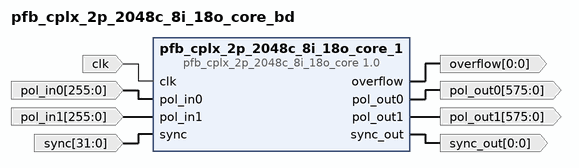
[diagram p0: block diagram of the top level]
# Vivado block design pfb_cplx_2p_2048c_8i_18o_core_bd, xcvu9p-flga2104-2-i, Vivado 2019.1.3
create_bd_design pfb_cplx_2p_2048c_8i_18o_core_bd

create_bd_port -dir I -type clk clk
create_bd_port -dir O -from 0 -to 0 -type data overflow
create_bd_port -dir I -from 255 -to 0 -type data pol_in0
create_bd_port -dir I -from 255 -to 0 -type data pol_in1
create_bd_port -dir O -from 575 -to 0 -type data pol_out0
create_bd_port -dir O -from 575 -to 0 -type data pol_out1
create_bd_port -dir I -from 31 -to 0 -type data sync
create_bd_port -dir O -from 0 -to 0 -type data sync_out

create_bd_cell -type ip -vlnv User_Company:SysGen:pfb_cplx_2p_2048c_8i_18o_core:1.0 pfb_cplx_2p_2048c_8i_18o_core_1

# ---- connections ----

connect_bd_net [get_bd_ports clk] [get_bd_pins pfb_cplx_2p_2048c_8i_18o_core_1/clk]
connect_bd_net [get_bd_pins pfb_cplx_2p_2048c_8i_18o_core_1/overflow] [get_bd_ports overflow]
connect_bd_net -net pol_in0_1 [get_bd_ports pol_in0] [get_bd_pins pfb_cplx_2p_2048c_8i_18o_core_1/pol_in0]
connect_bd_net -net pol_in1_1 [get_bd_ports pol_in1] [get_bd_pins pfb_cplx_2p_2048c_8i_18o_core_1/pol_in1]
connect_bd_net [get_bd_pins pfb_cplx_2p_2048c_8i_18o_core_1/pol_out0] [get_bd_ports pol_out0]
connect_bd_net [get_bd_pins pfb_cplx_2p_2048c_8i_18o_core_1/pol_out1] [get_bd_ports pol_out1]
connect_bd_net [get_bd_ports sync] [get_bd_pins pfb_cplx_2p_2048c_8i_18o_core_1/sync]
connect_bd_net [get_bd_pins pfb_cplx_2p_2048c_8i_18o_core_1/sync_out] [get_bd_ports sync_out]

validate_bd_design
save_bd_design
